# EAGLE design 05A-005 (EAGLE 9.6.2)
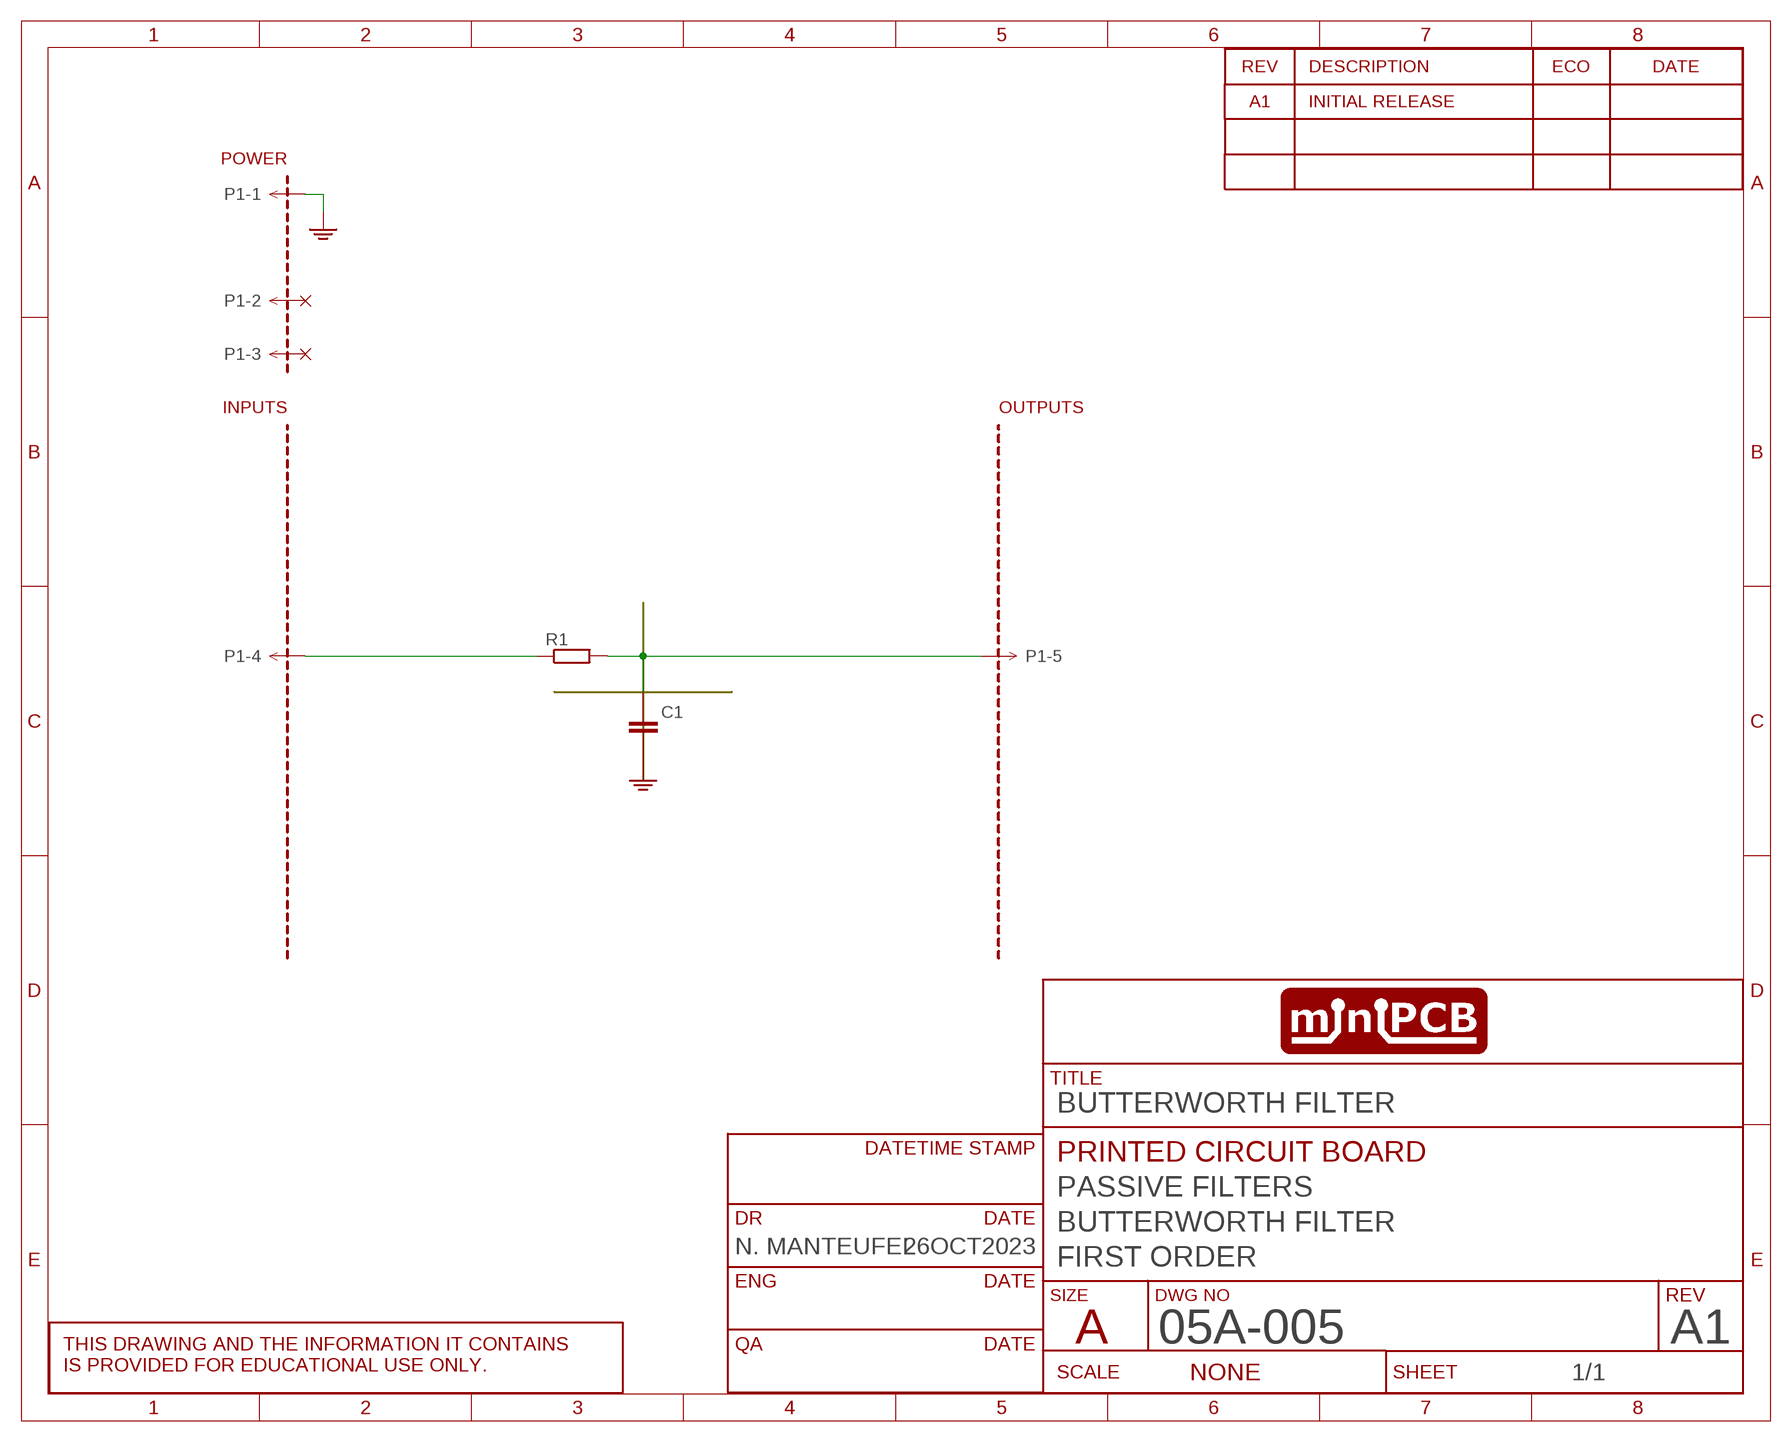
[diagram p0: schematic, sheet 1]
SHEET1 (SCHEMATIC): CIRCUIT_CATEGORY: PASSIVE FILTERS; CIRCUIT_NAME: BUTTERWORTH FILTER; CIRCUIT_VARIANT: FIRST ORDER; DR: N. MANTEUFEL; DR_DATE: 26OCT2023; PCB_PCBA: PRINTED CIRCUIT BOARD; REVA: A1; REVISION: A1; TITLE: BUTTERWORTH FILTER

## Parts
C1  CAPACITORTHD  [C050-024X044]
P1  MINIPCB_5P5P  [PINS_1X5]
PCB1  MINIPCB_0P00A-20X25  [MINIPCB_00A_20X25]
R1  RESISTORTHD  [0204/10]

## Nets
GND: C1.2(-) P1.1
N$1: C1.1(+) P1.5 R1.2
N$2: P1.4 R1.1
Unconnected: P1.2 P1.3

## Library data of the parts
C1 = minipcb:CAPACITOR
P1 = minipcb:MINIPCB_5P
PCB1 = minipcb:MINIPCB_0P; CIRCUIT_CATEGORY: CIRCUIT CATEGORY; REVISION: A1; TITLE: TITLE
R1 = minipcb:RESISTOR

## Board
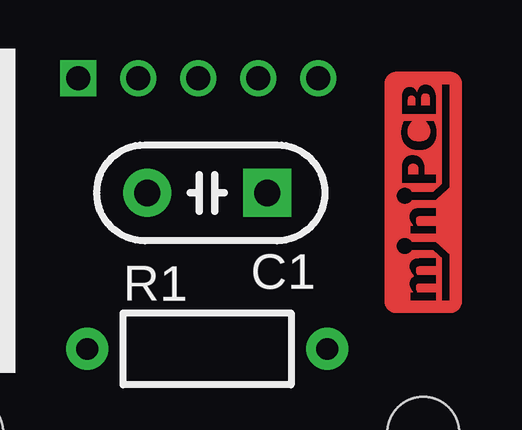
[diagram p1: board, top side]
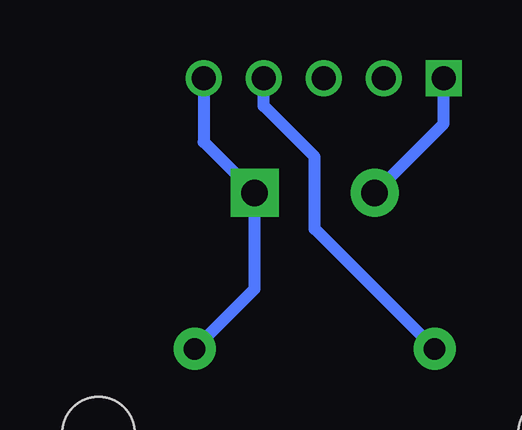
[diagram p2: board, bottom side, seen from below]

No outline drawn. Coordinates in mm, seen from the top.
Copper layers (1*16): Top 0.035mm / dielectric 1.5mm / Bottom 0.035mm
Design rules "default": minimum track width 6mil, minimum drill 0.35mm, track to track 6mil, track to pad 6mil, pad to pad 6mil, via to via 6mil, smd to smd 6mil, copper to edge 40mil, drill to drill 6mil, minimum pad ring 10mil, minimum via ring 8mil, stop-mask expansion 4mil, vias tented up to drill 0mil, thermal gap 10mil

### Footprints (pad centres in the part's own frame; a part is rotated, then mirrored left to right if it is on the bottom)
C050-024X044 = drill 1.1 pad 2 square: 1 -2.5,0 | drill 1.1 pad 2: 2 2.5,0
PINS_1X5 = drill 1 square: 1 0,0 | drill 1: 2 2.5,0; 3 5,0; 4 7.5,0; 5 10,0
MINIPCB_00A_20X25 = hole 3: 22,3; 3,3
0204/10 = drill 0.9 pad 1.75: 1 -5,0; 2 5,0

### Placement (x,y rotation side)
C1  13,13 180 top
P1  7.62,17.78 0 top
PCB1  0,0 0 top
R1  13,6.5 0 top

### Tracks (layer width: path | path; a pad name or v marks a point on that pad's centre or on a via)
GND
  Bottom 0.5: C1.2 7.62,15.88 P1.1
N$1
  Bottom 0.5: P1.5 17.62,15.12 C1.1 15.5,9 R1.2
N$2
  Bottom 0.5: R1.1 13,11.5 13,14.5 15.12,16.62 P1.4